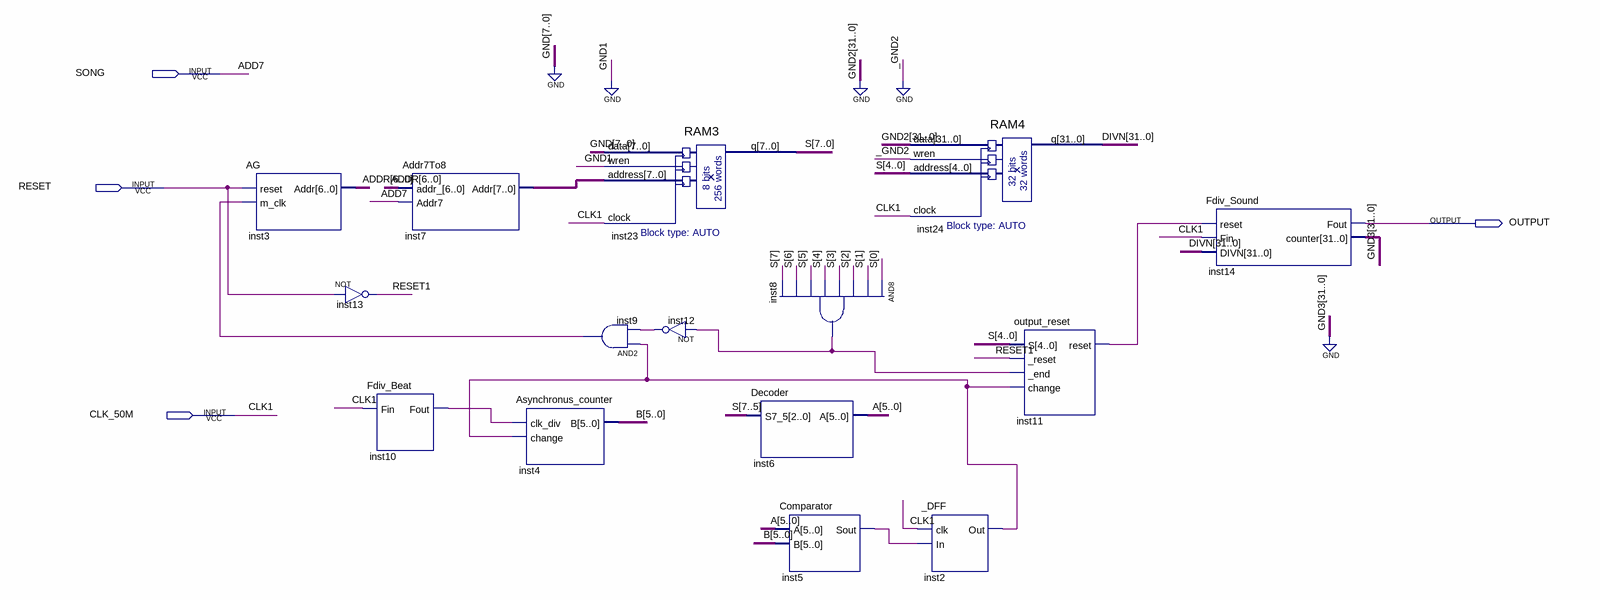
[diagram p0: schematic sheet]
// Quartus schematic hw3.bdf as structural Verilog: 15 symbols, 4 pins
module hw3 (
  input  SONG,
  input  RESET,
  input  CLK_50M,
  output OUTPUT
);

  wire inst2_out, inst5_sout, inst8_out, inst9_out, inst10_fout, inst11_reset, inst12_out, RESET1;
  wire [5:0] A, B;
  wire [6:0] ADDR;
  wire [7:0] inst7_addr, S;
  wire [31:0] DIVN, GND3;

  AG inst3 (.reset(RESET), .m_clk(inst9_out), .Addr(ADDR));
  not inst13 (RESET1, RESET);
  Addr7To8 inst7 (.addr_(ADDR), .Addr7(SONG), .Addr(inst7_addr));
  Fdiv_Beat inst10 (.Fin(CLK_50M), .Fout(inst10_fout));
  Asynchronus_counter inst4 (.clk_div(inst10_fout), .change(inst2_out), .B(B));
  RAM3 inst23 (.data({8{1'b0}}), .wren(1'b0), .address(inst7_addr), .clock(CLK_50M), .q(S));
  and inst9 (inst9_out, inst2_out, inst12_out);
  not inst12 (inst12_out, inst8_out);
  Decoder inst6 (.S7_5(S[7:5]), .A(A));
  and inst8 (inst8_out, S[0], S[1], S[2], S[3], S[4], S[5], S[6], S[7]);
  Comparator inst5 (.A(A), .B(B), .Sout(inst5_sout));
  RAM4 inst24 (.data({32{1'b0}}), .wren(1'b0), .address(S[4:0]), .clock(CLK_50M), .q(DIVN));
  _DFF inst2 (.clk(CLK_50M), .In(inst5_sout), .Out(inst2_out));
  output_reset inst11 (.S(S[4:0]), ._reset(RESET1), ._end(inst8_out), .change(inst2_out), .reset(inst11_reset));
  Fdiv_Sound inst14 (.reset(inst11_reset), .Fin(CLK_50M), .DIVN(DIVN), .Fout(OUTPUT), .counter(GND3));
  // also tied to GND on the sheet: {GND3[0], GND3[1], GND3[2], GND3[3], GND3[4], GND3[5], GND3[6], GND3[7], GND3[8], GND3[9], GND3[10], GND3[11], GND3[12], GND3[13], GND3[14], GND3[15], GND3[16], GND3[17], GND3[18], GND3[19], GND3[20], GND3[21], GND3[22], GND3[23], GND3[24], GND3[25], GND3[26], GND3[27], GND3[28], GND3[29], GND3[30], GND3[31]}

  // Other names for the same wires on the sheet: ADD7 = SONG; CLK1 = CLK_50M
endmodule
